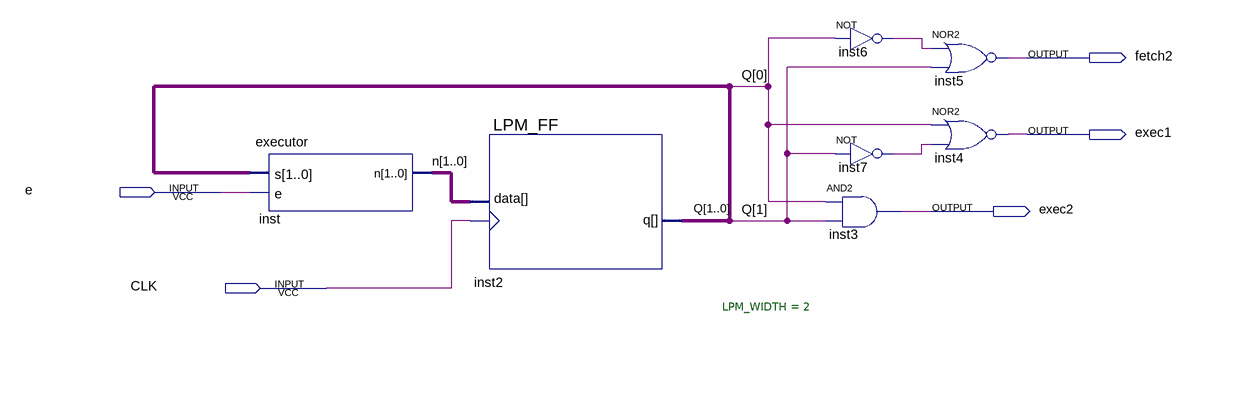
[diagram p0: schematic sheet]
// Quartus schematic StateMachine.bdf as structural Verilog: 7 symbols, 5 pins
module StateMachine (
  input  e,
  input  CLK,
  output fetch2,
  output exec1,
  output exec2
);

  wire inst6_out, inst7_out;
  wire [1:0] n, Q;

  executor inst (.s(Q), .e(e), .n(n));
  LPM_FF #(.LPM_WIDTH(2)) inst2 (.clock(CLK), .data(n), .q(Q));
  not inst6 (inst6_out, Q[0]);
  not inst7 (inst7_out, Q[1]);
  and inst3 (exec2, Q[0], Q[1]);
  nor inst5 (fetch2, inst6_out, Q[1]);
  nor inst4 (exec1, Q[0], inst7_out);
endmodule
